# EAGLE design clapclap1386 (EAGLE 6.3)
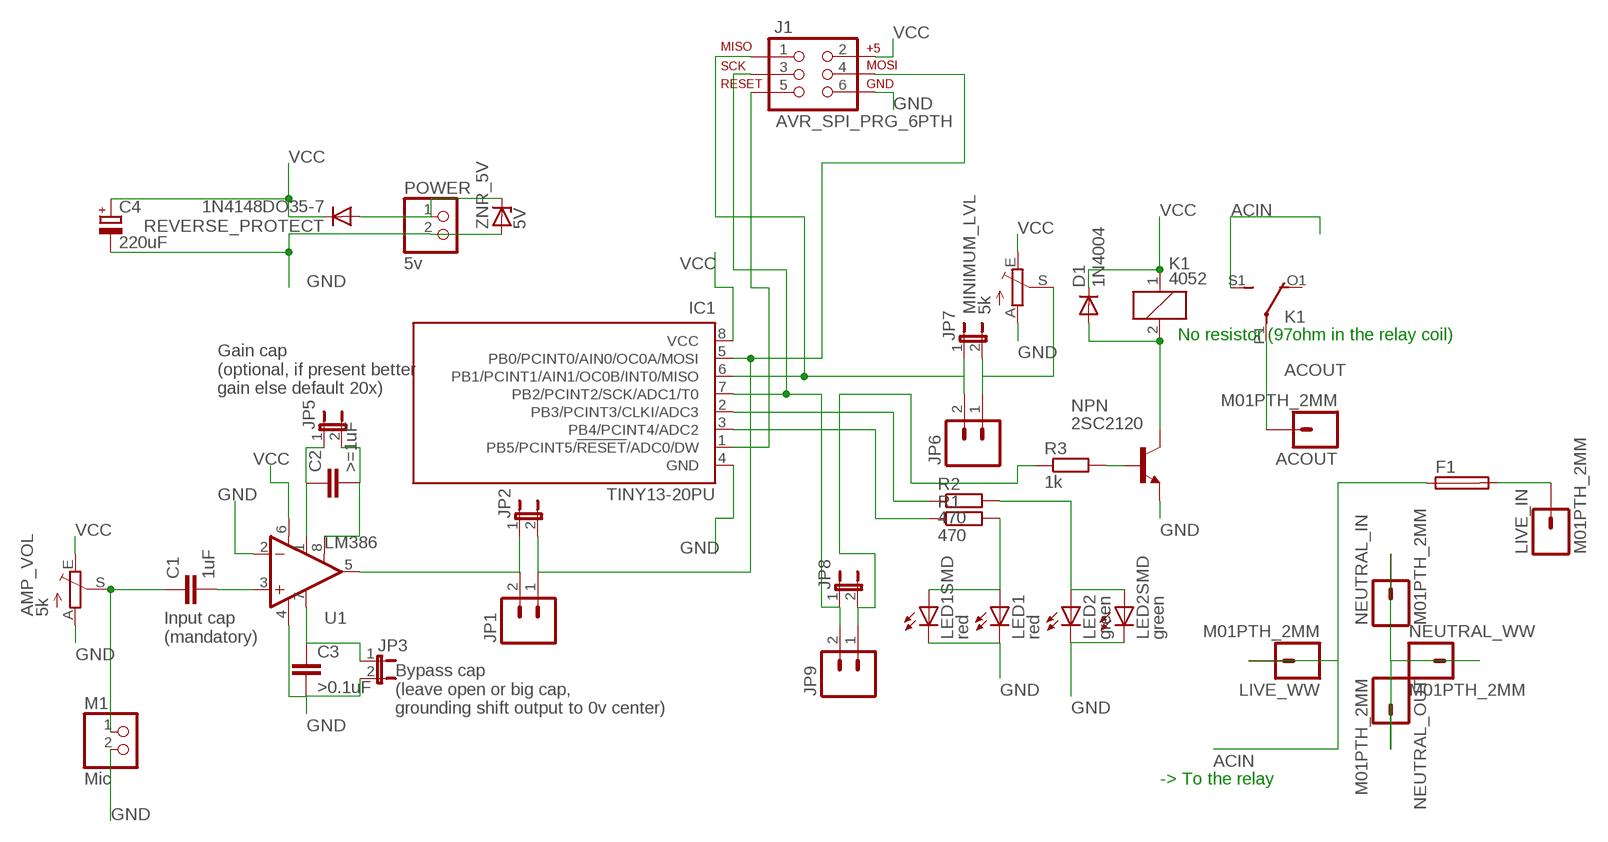
[diagram p0: schematic, sheet 1]

## Parts
ACOUT  M01PTH_2MM  [1X01_2MM]
AMP_VOL  5k  TRIM_EU-CT6  [CT6]
C1  1uF  C-EU050-024X044  [C050-024X044]
C2  >=1uF  C-EU050-024X044  [C050-024X044]
C3  >0.1uF  C-EU025-025X050  [C025-025X050]
C4  220uF  CPOL-EUE2,5-6E  [E2,5-6E]
D1  1N4004  [DO41-10]
F1  TE5  [TE5]
IC1  TINY13-20PU  [DIL08]
J1  AVR_SPI_PRG_6PTH  [2X3]
JP1  M02PTH  [1X02]
JP2  JUMPER-2SMD-NO  [SJ_2S-NO]
JP3  JUMPER-2SMD-NO  [SJ_2S-NO]
JP5  JUMPER-2SMD-NO  [SJ_2S-NO]
JP6  M02PTH  [1X02]
JP7  JUMPER-2SMD-NO  [SJ_2S-NO]
JP8  JUMPER-2SMD-NO  [SJ_2S-NO]
JP9  M02PTH  [1X02]
K1  4052  [F4052]
LED1  red  LED3MM  [LED3MM]
LED1SMD  red  LEDKA-3528ASYC  [KA-3528ASYC]
LED2  green  LED3MM  [LED3MM]
LED2SMD  green  LEDKA-3528ASYC  [KA-3528ASYC]
LIVE_IN  M01PTH_2MM  [1X01_2MM]
LIVE_WW  M01PTH_2MM  [1X01_2MM]
M1  Mic  PINHD-1X2  [1X02]
MINIMUM_LVL  5k  TRIM_EU-CT6  [CT6]
NEUTRAL_IN  M01PTH_2MM  [1X01_2MM]
NEUTRAL_OUT  M01PTH_2MM  [1X01_2MM]
NEUTRAL_WW  M01PTH_2MM  [1X01_2MM]
NPN  2SC2120  -NPN-TO92-ECB  [TO92-ECB]
POWER  5v  PINHD-1X2  [1X02]
R1  470  R-EU_0204/2V  [0204V]
R2  470  R-EU_0204/2V  [0204V]
R3  1k  R-EU_0207/2V  [0207/2V]
REVERSE_PROTECT  1N4148DO35-7  [DO35-7]
U1  LM386  [DIP08]
ZNR_5V  5V  ZENER-DIODEZD-2.5  [ZDIO-2.5]

## Nets
ACIN: F1.1 K1.S1(2:S) LIVE_WW.1
ACOUT: ACOUT.1 K1.P1(2:P)
GND: AMP_VOL.A C3.2 C4.- IC1.4(GND) J1.6 JP3.2 LED1.K(C) LED1SMD.C LED2.K(C) LED2SMD.C M1.2 MINIMUM_LVL.A NPN.E POWER.2 U1.2(-IN) U1.4(V-) ZNR_5V.A
N$1: C1.2 U1.3(+IN)
N$3: AMP_VOL.S C1.1 M1.1
N$4: IC1.2(PB3/PCINT3/CLKI/ADC3) R2.1
N$5: C2.1 JP5.1 U1.1(GAIN)
N$6: IC1.3(PB4/PCINT4/ADC2) R1.1
N$7: LED1.A LED1SMD.A R1.2
N$8: NPN.B R3.2
N$9: D1.A K1.2 NPN.C
N$10: IC1.5(PB0/PCINT0/AIN0/OC0A/MOSI) J1.4 JP1.1 JP2.2
N$11: LED2.A LED2SMD.A R2.2
N$12: IC1.6(PB1/PCINT1/AIN1/OC0B/INT0/MISO) J1.1 JP6.2 JP7.1
N$13: NEUTRAL_IN.1 NEUTRAL_OUT.1 NEUTRAL_WW.1
N$14: C2.2 JP5.2 U1.8(GAIN)
N$15: C3.1 JP3.1 U1.7(BP)
N$16: IC1.1(PB5/PCINT5/!RESET!/ADC0/DW) J1.5
N$17: JP1.2 JP2.1 U1.5(OUT)
N$18: POWER.1 REVERSE_PROTECT.A ZNR_5V.C
N$19: F1.2 LIVE_IN.1
N$21: JP6.1 JP7.2 MINIMUM_LVL.S
N$23: IC1.7(PB2/PCINT2/SCK/ADC1/T0) J1.3 JP8.1 JP9.2
N$24: JP8.2 JP9.1 R3.1
VCC: AMP_VOL.E C4.+ D1.C IC1.8(VCC) J1.2 K1.1 MINIMUM_LVL.E REVERSE_PROTECT.C U1.6(V+)
Unconnected: K1.O1(2:O) K1.O2(3:O) K1.P2(3:P) K1.S2(3:S)

## Notes on the sheet
- No resistor (97ohm in the relay coil)
- Gain cap
  (optional, if present better 
  gain else default 20x)
- Input cap
  (mandatory)
- Bypass cap
  (leave open or big cap,
  grounding shift output to 0v center)
- -> To the relay

## Library data of the parts
ACOUT LIVE_IN LIVE_WW NEUTRAL_IN NEUTRAL_OUT NEUTRAL_WW = SparkFun-Connectors:M01: Header 1 Standard 1-pin 0.1" header. Use with straight break away headers (SKU : PRT-00116), right angle break away headers (PRT-00553), swiss pins (PRT-00743), machine pins (PRT-00117), and female headers (PRT-00115).
AMP_VOL MINIMUM_LVL = pot:TRIM_EU-: POTENTIOMETER
C1-C3 = resistor:C-EU: CAPACITOR, European symbol
C4 = rcl:CPOL-EU: POLARIZED CAPACITOR, European symbol
D1 = diode:1N4004: DIODE general purpose rectifier, 1 A
F1 = fuse:TE5: FUSE Wickmann; OC_FARNELL: unknown; OC_NEWARK: unknown
IC1 = atmel:TINY13: 8-bit AVR Microcontroller with 1K Bytes In-System Programmable Flash Source: http://www.atmel.com/dyn/resources/prod_documents/2535S.pdf; MPN: ATTINY13-20PU; OC_FARNELL: 9171550; OC_NEWARK: 96K6521
J1 = SparkFun-Connectors:AVR_SPI_PRG_6: AVR ISP 6 Pin This is the reduced ISP connector for AVR programming. Common on Arduino. This footprint will take up less PCB space and can be used with a 10-pin to 6-pin adapter such as SKU: BOB-08508
JP1 JP6 JP9 = SparkFun-Connectors:M02: Header 2 Standard 2-pin 0.1" header. Use with straight break away headers (SKU : PRT-00116), right angle break away headers (PRT-00553), swiss pins (PRT-00743), machine pins (PRT-00117), and female headers (PRT-00115). Molex polarized connector foot print use with SKU : PRT-08233 with associated crimp pins and housings.
JP2 JP3 JP5 JP7 JP8 = SparkFun-Passives:JUMPER-2: Jumper Basic 0.1" spaced jumper. Use with breakaway headers.
K1 = relay:4052: RELAY 2 x switch, Finder; OC_FARNELL: unknown; OC_NEWARK: unknown
LED1 LED1SMD LED2 LED2SMD = led:LED: LED OSRAM: - CHIPLED LG R971, LG N971, LY N971, LG Q971, LY Q971, LO R971, LY R971 LH N974, LH R974 LS Q976, LO Q976, LY Q976 LO Q996 - Hyper CHIPLED LW Q18S LB Q993, LB Q99A, LB R99A - SideLED LS A670, LO A670, LY A670, LG A670, LP A670 LB A673, LV A673, LT A673, LW A673 LH A674 LY A675 LS A676, LA A676, LO A676, LY A676, LW A676 LS A679, LY A679, LG A679 - Hyper Micro SIDELED® LS Y876, LA Y876, LO Y876, LY Y876 LT Y87S - SmartLED LW L88C, LW L88S LB L89C, LB L89S, LG L890 LS L89K, LO L89K, LY L89K LS L896, LA L896, LO L896, LY L896 - TOPLED LS T670, LO T670, LY T670, LG T670, LP T670 LSG T670, LSP T670, LSY T670, LOP T670, LYG T670 LG T671, LOG T671, LSG T671 LB T673, LV T673, LT T673, LW T673 LH T674 LS T676, LA T676, LO T676, LY T676, LB T676, LH T676, LSB T676, LW T676 LB T67C, LV T67C, LT T67C, LS T67K, LO T67K, LY T67K, LW E67C LS E67B, LA E67B, LO E67B, LY E67B, LB E67C, LV E67C, LT E67C LW T67C LS T679, LY T679, LG T679 LS T770, LO T770, LY T770, LG T770, LP T770 LB T773, LV T773, LT T773, LW T773 LH T774 LS E675, LA E675, LY E675, LS T675 LS T776, LA T776, LO T776, LY T776, LB T776 LHGB T686 LT T68C, LB T68C - Hyper Mini TOPLED® LB M676 - Mini TOPLED Santana® LG M470 LS M47K, LO M47K, LY M47K Source: http://www.osram.convergy.de LUXEON: - LUMILED® LXK2-PW12-R00, LXK2-PW12-S00, LXK2-PW14-U00, LXK2-PW14-V00 LXK2-PM12-R00, LXK2-PM12-S00, LXK2-PM14-U00 LXK2-PE12-Q00, LXK2-PE12-R00, LXK2-PE12-S00, LXK2-PE14-T00, LXK2-PE14-U00 LXK2-PB12-K00, LXK2-PB12-L00, LXK2-PB12-M00, LXK2-PB14-N00, LXK2-PB14-P00, LXK2-PB14-Q00 LXK2-PR12-L00, LXK2-PR12-M00, LXK2-PR14-Q00, LXK2-PR14-R00 LXK2-PD12-Q00, LXK2-PD12-R00, LXK2-PD12-S00 LXK2-PH12-R00, LXK2-PH12-S00 LXK2-PL12-P00, LXK2-PL12-Q00, LXK2-PL12-R00 Source: www.luxeon.com KINGBRIGHT: KA-3528ASYC Source: www.kingbright.com
M1 POWER = pinhead:PINHD-1X2: PIN HEADER
NPN = transistor:*-NPN-: NPN Transistror BF959 corrected 2008.03.06
R1-R3 = resistor:R-EU_: RESISTOR, European symbol
REVERSE_PROTECT = diode:1N4148: DIODE high speed (Philips)
U1 = SparkFun-AnalogIC:LM386: low voltage audio power amplifier
ZNR_5V = diode:ZENER-DIODE: Z-Diode

## Board
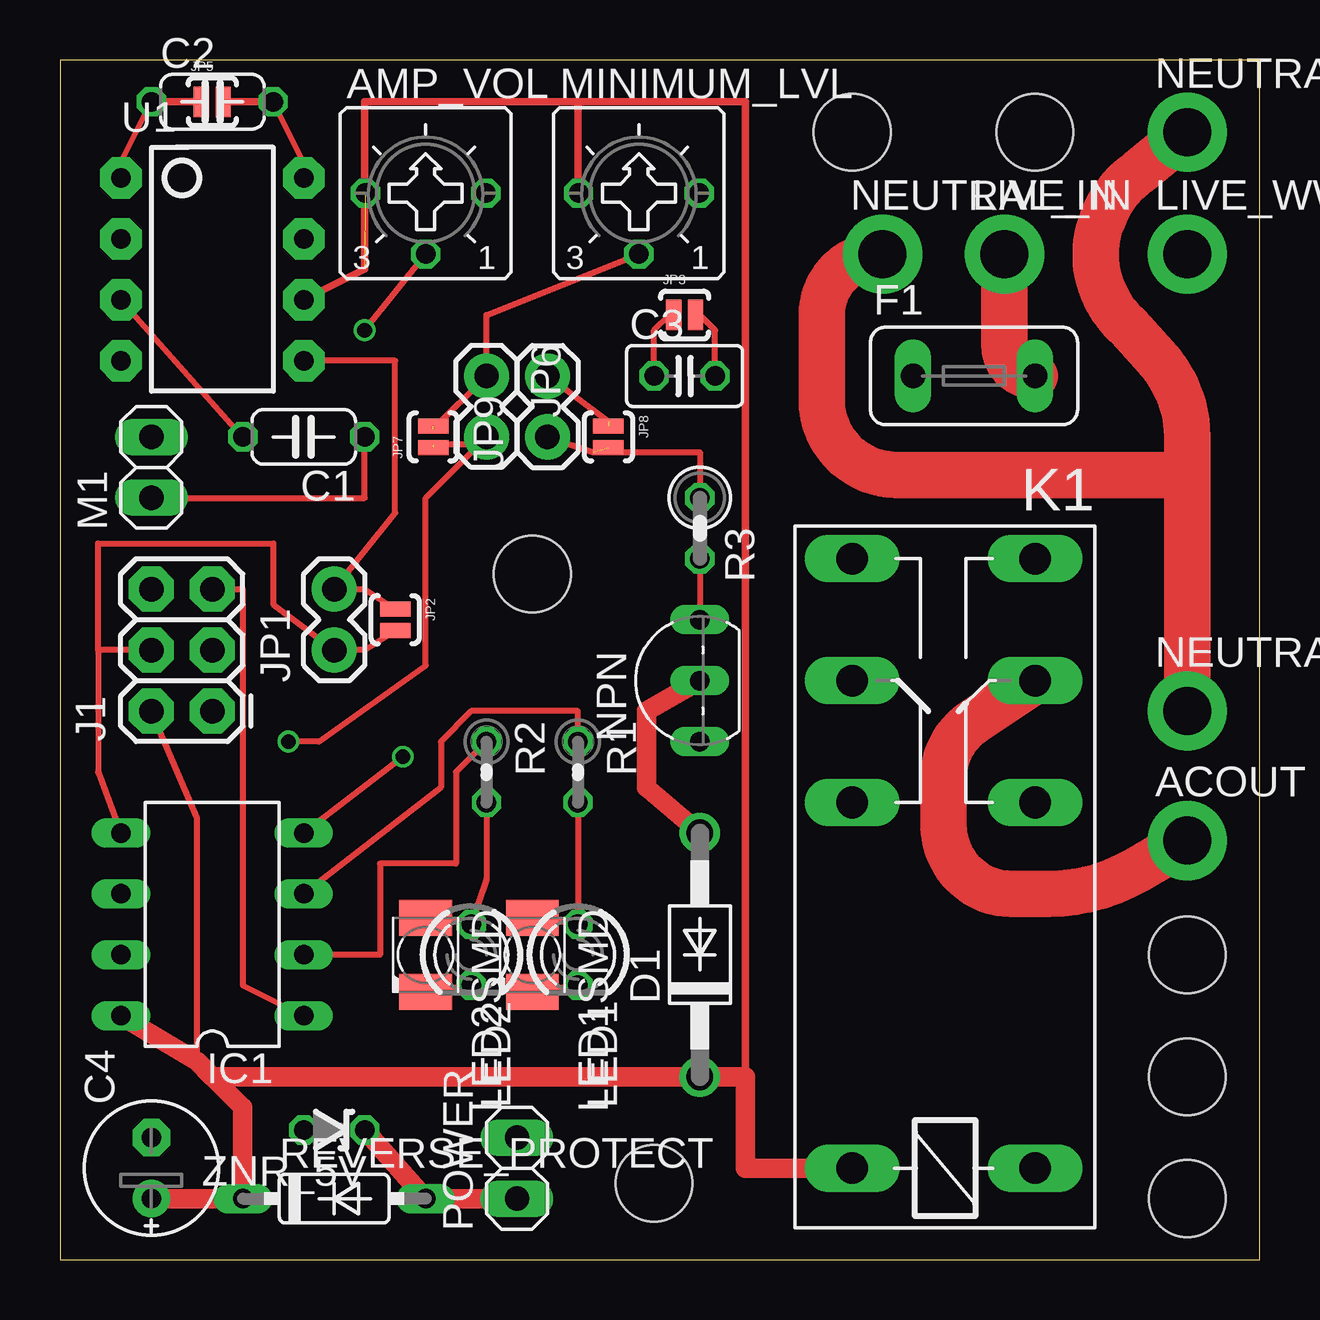
[diagram p1: board, top side]
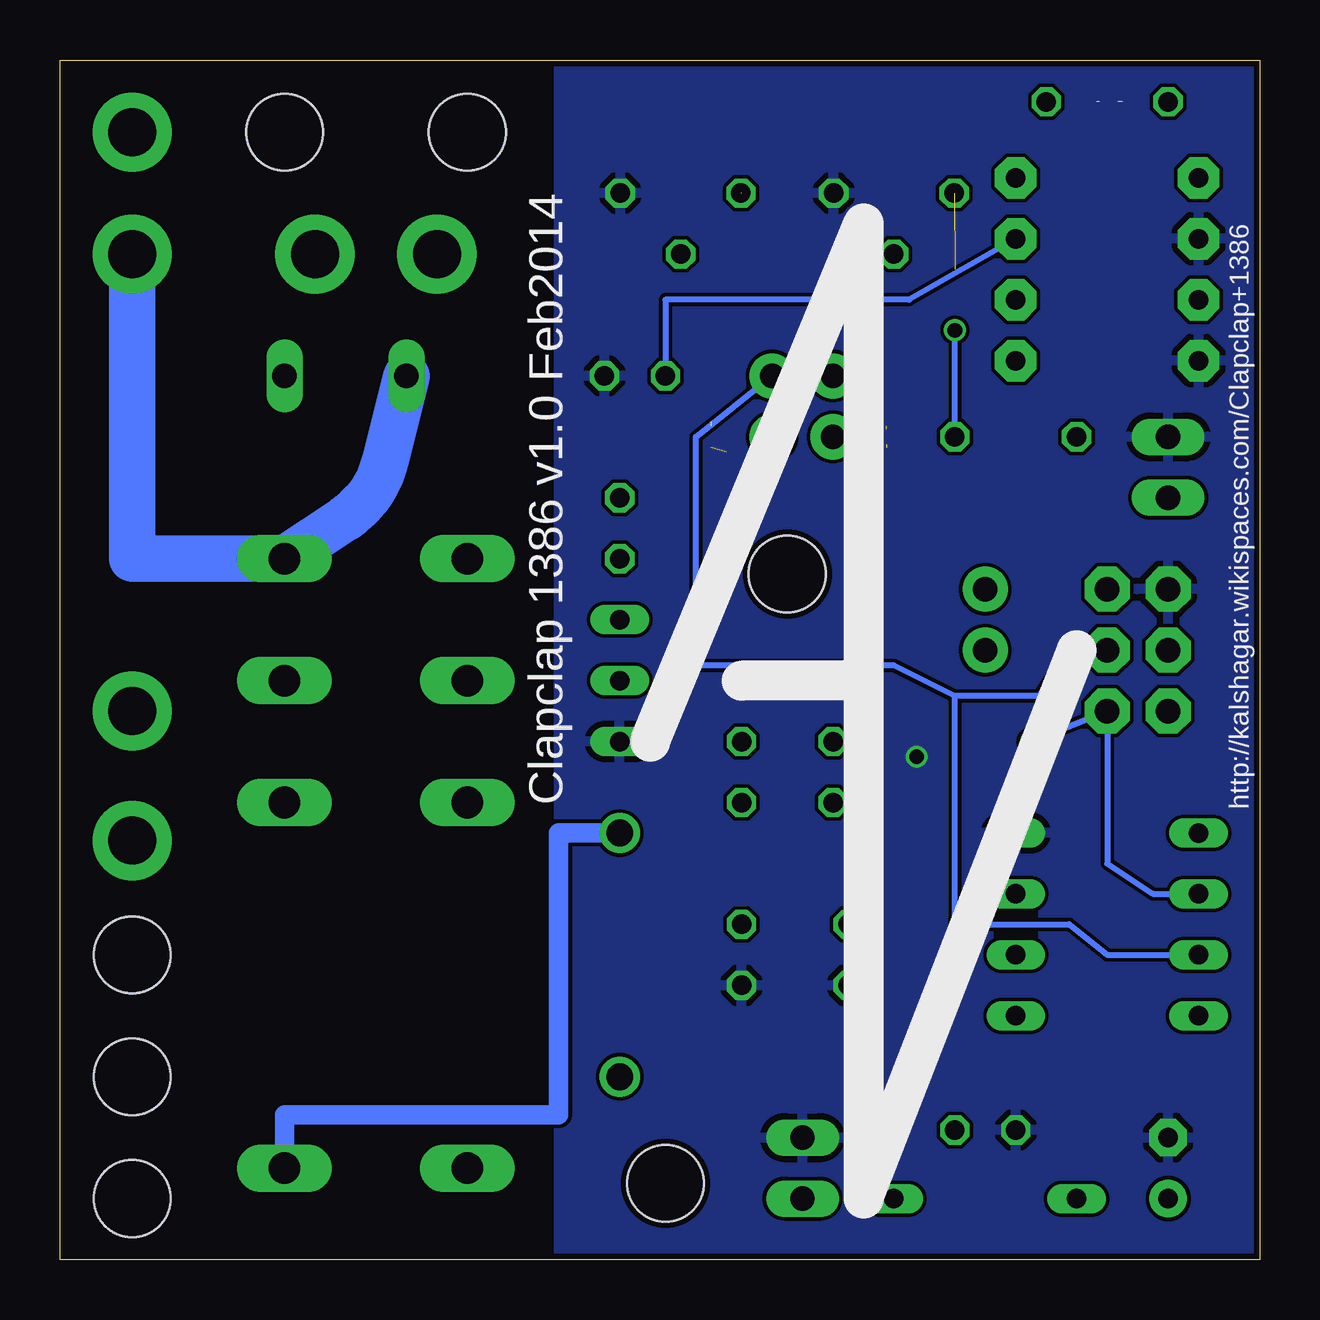
[diagram p2: board, bottom side, seen from below]

Size 50 x 50 mm. Coordinates in mm from the lower left corner, seen from the top.
Outline: 0,0 50,0 50,50 0,50 0,0
Copper layers (1*2*15*16): Top 0.035mm / dielectric 0.2mm / layer 2 0.0175mm / dielectric 1.1mm / layer 15 0.0175mm / dielectric 0.2mm / Bottom 0.035mm
Design rules "SeeedStudio_DRU_no_angle_20130527": minimum track width 6mil, minimum drill 12mil, track to track 6mil, track to pad 6mil, pad to pad 6mil, via to via 6mil, smd to smd 0mil, copper to edge 10mil, drill to drill 10mil, minimum pad ring 6mil, minimum via ring 6mil, stop-mask expansion 2mil, vias tented up to drill 25mil, thermal gap 10mil
Holes 3.2 mm at 40.64,46.99 33.02,46.99 46.99,7.62 46.99,12.7 19.68,28.57 24.77,3.17 46.99,2.54

### Footprints (pad centres in the part's own frame; a part is rotated, then mirrored left to right if it is on the bottom)
1X01_2MM = drill 2 pad 3.302: 1 0,0
CT6 = drill 0.813 octagon: A 2.515,0; E -2.515,0; S 0,-2.54
C050-024X044 = drill 0.813 octagon: 1 -2.54,0; 2 2.54,0
C025-025X050 = drill 0.813 octagon: 1 -1.27,0; 2 1.27,0
E2,5-6E = drill 0.813 pad 1.575: + -1.27,0 | drill 0.813 pad 1.575 octagon: - 1.27,0
DO41-10 = drill 1.118: A 5.08,0; C -5.08,0
TE5 = drill 1.016 long: 1 -2.54,0; 2 2.54,0
DIL08 = drill 0.813 long: 1 -3.81,-3.81; 2 -1.27,-3.81; 3 1.27,-3.81; 4 3.81,-3.81; 5 3.81,3.81; 6 1.27,3.81; 7 -1.27,3.81; 8 -3.81,3.81
2X3 = drill 1.016 pad 1.88 octagon: 1 0,0; 2 0,2.54; 3 2.54,0; 4 2.54,2.54; 5 5.08,0; 6 5.08,2.54
1X02 = drill 1.016 pad 1.88: 1 0,0; 2 2.54,0
SJ_2S-NO = smd 0.635 x 1.27: 1 -0.45,0; 2 0.45,0
F4052 = drill 1.321 long: 1 -3.81,3.81; 2 -3.81,-3.81; O1 11.43,-3.81; O2 11.43,3.81; P1 16.51,-3.81; P2 16.51,3.81; S1 21.59,-3.81; S2 21.59,3.81
LED3MM = drill 0.813 octagon: A -1.27,0; K 1.27,0
KA-3528ASYC = smd 1.5 x 2.2: A -1.55,0; C 1.55,0
1X02' = drill 1.016 long: 1 -1.27,0; 2 1.27,0
TO92-ECB = drill 0.813 long: B 2.54,0; C 0,0; E -2.54,0
0204V = drill 0.813 octagon: 1 -1.27,0; 2 1.27,0
0207/2V = drill 0.813 octagon: 1 -1.27,0; 2 1.27,0
DO35-7 = drill 0.813 long: A 3.81,0; C -3.81,0
DIP08 = drill 0.813 pad 1.727 octagon: 1 -3.81,-3.81; 2 -1.27,-3.81; 3 1.27,-3.81; 4 3.81,-3.81; 5 3.81,3.81; 6 1.27,3.81; 7 -1.27,3.81; 8 -3.81,3.81
ZDIO-2.5 = drill 0.813 octagon: A 1.27,0; C -1.27,0

### Placement (x,y rotation side)
ACOUT  46.99,17.46 0 top
AMP_VOL  15.24,44.45 0 top
C1  10.16,34.29 180 top
C2  6.35,48.26 0 top
C3  26.04,36.83 0 top
C4  3.81,3.81 90 top
D1  26.67,12.7 90 top
F1  38.1,36.83 0 top
IC1  6.35,13.97 90 top
J1  6.35,22.86 90 top
JP1  11.43,25.4 90 top
JP2  13.97,26.67 270 top
JP3  26.04,39.37 0 top
JP5  6.35,48.26 0 top
JP6  17.78,36.83 270 top
JP7  15.56,34.29 90 top
JP8  22.86,34.29 270 top
JP9  20.32,34.29 90 top
K1  36.83,7.62 90 top
LED1  21.59,12.7 270 top
LED1SMD  19.68,12.7 270 top
LED2  17.14,12.7 270 top
LED2SMD  15.24,12.7 270 top
LIVE_IN  39.37,41.91 0 top
LIVE_WW  46.99,41.91 0 top
M1  Mic  [1X02']  3.81,33.02 90 top
MINIMUM_LVL  24.13,44.45 0 top
NEUTRAL_IN  34.29,41.91 0 top
NEUTRAL_OUT  46.99,22.86 0 top
NEUTRAL_WW  46.99,46.99 0 top
NPN  26.67,24.13 90 top
POWER  5v  [1X02']  19.05,3.81 90 top
R1  21.59,20.32 270 top
R2  17.78,20.32 270 top
R3  26.67,30.48 270 top
REVERSE_PROTECT  11.43,2.54 0 top
U1  6.35,41.27 270 top
ZNR_5V  11.43,5.4 180 top

### Tracks (layer width: path | path; a pad name or v marks a point on that pad's centre or on a via)
ACIN
  Bottom 1.93: LIVE_WW.1 46.99,29.21 K1.S1 38.12,30.89 arc-42 36.45,33.26 F1.1
ACOUT
  Top 1.93: ACOUT.1 44.91,16.25 arc-30 41.18,15.24 39.67,15.24 arc-90 36.83,18.08 36.83,20.07 arc-56 38.09,22.43 K1.P1
GND  (via drill 0.6)
  Top 0.254: C3.2 27.3,38.73 26.67,39.37 JP3.2 | LED1.K LED1SMD.C | LED2.K LED2SMD.C | IC1.4 v14.29,20.95
  pour Bottom: -2.54,52.07 29.21,52.07 29.21,-2.54 -2.54,-2.54
N$1
  Top 0.254: U1.3 C1.2
N$3  (via drill 0.61)
  Top 0.254: M1.1 12.7,31.75 C1.1 | v12.7,38.73 AMP_VOL.S
  Bottom 0.254: C1.1 v12.7,38.73
N$4
  Top 0.254: IC1.2 13.34,12.7 13.34,16.51 16.51,16.51 16.51,20.32 R2.1
N$5  (1 unrouted)
  Top 0.254: C2.1 2.54,45.72 U1.1
  Top 0.305: C2.1 5.71,48.26
N$6
  Top 0.254: IC1.3 15.88,19.68 15.88,21.59 17.14,22.86 21.59,22.86 R1.1
N$7
  Top 0.254: LED1SMD.A LED1.A R1.2
N$8
  Top 0.254: R3.2 NPN.B
N$9
  Top 0.813: NPN.C 24.45,22.86 24.45,19.68 D1.A
  Bottom 0.813: K1.2 40.64,6.03 29.21,6.03 29.21,17.78 D1.A
N$10
  Top 0.254: JP2.2 12.7,25.4 JP1.1 8.89,27.3 8.89,29.84 1.59,29.84 1.59,25.4 | IC1.5 1.59,20.32 1.59,25.4 | J1.4 1.59,25.4
N$11
  Top 0.254: LED2SMD.A LED2.A 17.78,15.88 R2.2
N$12  (via drill 0.6)  (1 unrouted)
  Top 0.254: v9.53,21.59 10.79,21.59 15.24,24.77 15.24,31.75 JP6.2 17.14,33.97 15.56,33.97
  Bottom 0.254: IC1.6 4.45,15.24 6.35,16.51 J1.1 v9.53,21.59
N$13
  Top 1.93: 46.99,32.7 46.99,34.27 arc43 45.69,37.62 44.54,38.86 arc-43 43.18,41.55 43.18,42.17 arc-51 45.02,45.38 NEUTRAL_WW.1 | 46.99,32.7 NEUTRAL_OUT.1 | NEUTRAL_IN.1 arc90 31.75,39.37 31.75,35.83 arc90 34.88,32.7 46.99,32.7
N$14  (1 unrouted)
  Top 0.254: C2.2 10.16,45.72 U1.8
  Top 0.305: C2.2 6.67,48.26
N$15
  Top 0.254: C3.1 24.77,38.73 25.4,39.37 JP3.1
  Bottom 0.254: C3.1 24.77,40.01 14.61,40.01 U1.7
N$16
  Top 0.254: IC1.1 7.62,11.43 7.62,27.94 J1.5
N$17
  Top 0.254: JP2.1 12.7,27.94 JP1.2 13.97,31.11 13.97,37.47 U1.5
N$18
  Top 0.813: ZNR_5V.C REVERSE_PROTECT.A POWER.1
N$19
  Top 1.93: LIVE_IN.1 39.37,38.1 arc90 F1.2
N$21  (1 unrouted)
  Top 0.254: 15.56,34.61 JP6.1 17.78,39.37 MINIMUM_LVL.S
N$23  (1 unrouted)
  Top 0.254: 22.86,34.92 JP9.2
  Bottom 0.254: IC1.7 6.35,12.7 7.94,13.97 12.7,13.97 12.7,23.5 | 12.7,23.5 9.21,23.5 7.94,25.4 J1.3 | 12.7,23.5 15.24,24.77 23.5,24.77 23.5,34.29 JP9.2
N$24  (1 unrouted)
  Top 0.254: JP9.1 22.23,33.66 26.67,33.66 R3.1
VCC  (2 unrouted)
  Top 0.254: J1.2 5.71,18.41 5.71,8.26
  Top 0.305: 28.57,7.62 28.57,48.26 21.59,48.26 | 21.59,48.26 21.59,44.45 | 21.59,48.26 12.7,48.26 12.7,41.27 U1.6
  Top 0.813: K1.1 28.57,3.81 28.57,7.62 D1.C 6.35,7.62 | 6.35,7.62 7.62,6.35 REVERSE_PROTECT.C C4.+ | 6.35,7.62 5.71,8.26 IC1.8

### Text on the board
bNames: Clapclap 1386 v1.0 Feb2014 | http://kalshagar.wikispaces.com/Clapclap+1386
Document: N | C2 | AMP_VOL | MIN_LVL | LM386 | A/C IN | L | N | L | J2 | J3 | C3 | A/C / WWART | Fuse/PTC | C1 | +MIC- | R3 | J1 | B | A/C / OUT | C | NPN | R2 | R1 | E | N | L | Relay | 942H-2C-5DS | Attiny13 | LED CLAP | LED SWTCH | - | - | D1 | C4 | -ZNR+ | GND | Clap clap ! / [1386] | 5v / VCC | RVRS_PROTECT